# Altium schematic sheet 1_P1.schdoc
size 307 x 218 mm; Symbol: Drawing-Symbol_A4; Device: Drawing-Symbol_A4; Company: 嘉立创EDA; Version: V1.0; Page Size: A4; @Project Name: 25国赛; @Page Count: 1; @Update Date: 2025-08-01; @Create Date: 2025-08-01; @Schematic Name: Schematic1_1; @Page No: 1; @Page Name: P1; @Create Time: 12:12:55; @Update Time: 12:12:57; Width: 1170; Height: 825; Region Start: 1; X Region Count: 6; Y Region Count: 4; Blade Width: 10; Title Block Position: 3; @Board Name: OPA365跟随
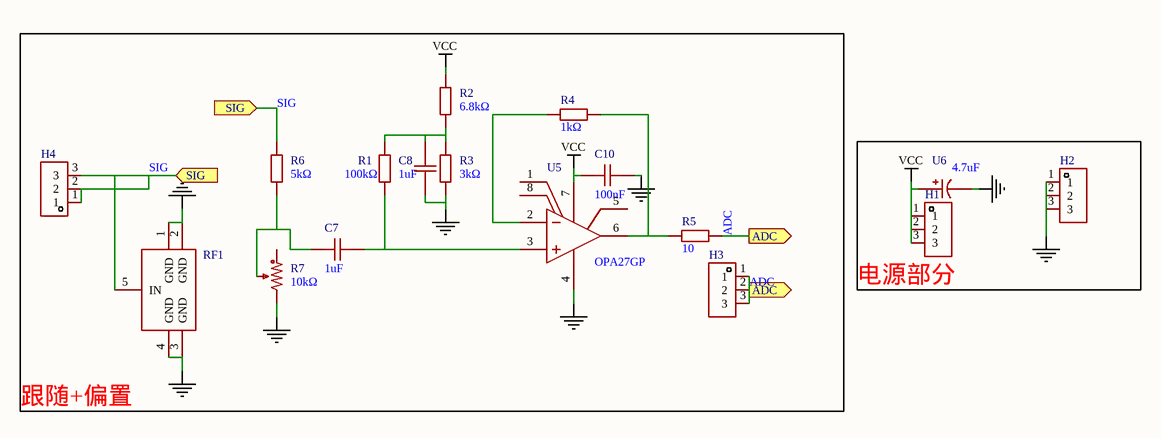
[diagram p0: 1_P1.schdoc]

## Parts
C7  1uF  [CAP-TH_L5.5-W3.8-P3.50-D0.6]
C8  1uF  [CAP-TH_L5.5-W3.8-P3.50-D0.6]
C10  100nF  [CAP-TH_L5.0-W2.5-P5.00-D1.0]
H1  PZ254V-11-03P  [HDR-TH_3P-P2.54-V-M]  (value not drawn)
H2  PZ254V-11-03P  [HDR-TH_3P-P2.54-V-M]  (value not drawn)
H3  PZ254V-11-03P  [HDR-TH_3P-P2.54-V-M]  (value not drawn)
H4  PZ254V-11-03P  [HDR-TH_3P-P2.54-V-M]  (value not drawn)
R1  100kΩ  [RES-TH_BD2.7-L6.2-P10.20-D0.4]
R2  6.8kΩ  [RES-TH_BD2.7-L6.2-P10.20-D0.4]
R3  3kΩ  [RES-TH_BD2.7-L6.2-P10.20-D0.4]
R4  1kΩ  [RES-TH_BD2.3-L6.5-P10.50-D0.5]
R5  10  [RES-TH_BD2.3-L6.5-P10.50-D0.5]
R6  5kΩ  [RES-TH_BD2.7-L6.2-P10.20-D0.4]
R7  10kΩ  [RES-ADJ-TH_3P-L10.0-W10.0-P2.50-L]
RF1  KH-SMA-K513-G  [ANT-TH_KH-SMA-K513-G]  (value not drawn)
U5  OPA27GP  [PDIP-8_L9.6-W6.4-P2.54-LS7.6-BL]
U6  4.7uF  [CAP-TH_BD8.0-P3.50-D0.6-FD_1]

## Blocks framed on the sheet
跟随+偏置: C7 C8 C10 H3 H4 R1-R7 RF1 U5
电源部分: H1 H2 U6

## Ports
ADC (out), SIG (in)

## Nets
GND: C8.1 C10.2 H2.1 H2.2 H2.3 R3.1 R7.3 RF1.1(GND) RF1.2(GND) RF1.3(GND) RF1.4(GND) U5.4(-VCC) U6.2
VCC: C10.1 H1.1 H1.2 H1.3 R2.2 U5.7(+VCC) U6.1
ADC: H3.1 H3.2 H3.3 R5.1 ; port ADC
SIG: H4.1 H4.2 H4.3 R6.2 RF1.5(IN) ; port SIG
NetC7_1: C7.1 R6.1 R7.2
NetC7_2: C7.2 R1.1 U5.3(IN+)
NetC8_2: C8.2 R1.2 R2.1 R3.2
NetR4_1: R4.1 R5.2 U5.6(OUT)
NetR4_2: R4.2 U5.2(IN-)

Not connected (* = marked no-connect by the designer): R7 1; U5 1(Offset_Trim) 5(NC) 8(Offset_Trim)

## Notes on the sheet
- 1
- 2
- 3
- 4
- 5
- 6
- A
- B
- C
- 原理图
- Schematic1_1
- 创建日期
- 更新日期
- 2025-08-01
- 板子
- 绘制
- OPA365跟随
- 图页
- P1
- D
- 审阅
- 版本
- 尺寸
- 25国赛
- 页    1    共    1
- V1.0
- A4
- 嘉立创EDA

## Library data of the parts
C7 C8 = CD1E106MC9BER2F100: Manufacturer: Dersonic(德尔创); Add into BOM: yes; Tolerance: ±20%; Voltage Rated: 25V; Temperature Coefficient: X5R; Symbol: CD1E106MC9BER2F100; Device: CD1E106MC9BER2F100; Supplier: LCSC; Manufacturer Part: CD1E106MC9BER2F100; Value: 1uF; JLCPCB Part Class: 扩展库; LCSC Part Name: 10uF ±20% 25V; Supplier Footprint: 插件,P=5.08mm; Datasheet: https://atta.szlcsc.com/upload/public/pdf/source/20210512/C2761733_48A4F8FFA54EF14BEC181E01EC41507A.pdf; Convert to PCB: yes
C10 = CC1H104MC1FD3F6C10MF: Manufacturer: Dersonic(德尔创); Add into BOM: yes; Tolerance: ±20%; Voltage Rated: 50V; Temperature Coefficient: Y5V; φD: 6mm; Body Thickness: 2.2mm; Symbol: CC1H104MC1FD3F6C10MF; Device: CC1H104MC1FD3F6C10MF; Supplier: LCSC; Supplier Part: C254085; Manufacturer Part: CC1H104MC1FD3F6C10MF; Value: 100nF; JLCPCB Part Class: 扩展库; LCSC Part Name: 100nF ±20% 50V; Supplier Footprint: 插件,P=5.08mm; Datasheet: https://atta.szlcsc.com/upload/public/pdf/source/20200826/C254085_159DD65BF32BF11C9168D341BCE23E6F.pdf; Convert to PCB: yes; Lead Spacing: 5.08mm
H1-H4 = PZ254V-11-03P: Manufacturer: XFCN(兴飞); Symbol: PZ254V-11-03P_C2937625; Add into BOM: yes; Pin Structure: 1x3P; Pitch: 2.54mm; Circluar Pins/Square Pins: 方针; Current Rating (Max): 3A; Voltage Rating (Max): 250V; Device: PZ254V-11-03P; LCSC Part Name: 间距:2.54mm 1x3P 直插 方针; Supplier Part: C2937625; Manufacturer Part: PZ254V-11-03P; Supplier Footprint: 插件,P=2.54mm; JLCPCB Part Class: 扩展库; Datasheet: https://atta.szlcsc.com/upload/public/pdf/source/20200309/C492402_8335C3D49C4E4C618838D59BB1D024C1.pdf; Supplier: LCSC; Convert to PCB: yes; Row Spacing: -; Mounting Type: 直插; Number of Rows: 单排; Number of Pins: 3P; Length of Mating Pin: 6mm; Insulation Height: 2.5mm; Length of End Connection Pin: 3mm; Operating Temperature Range: -40℃~+105℃; Color: 黑色
R1-R3 R6 = MF1/4W-100K±1%-OT26: Manufacturer: VO(翔胜); Add into BOM: yes; Tolerance: ±1%; Overload Voltage (Max): 250V; Power(Watts): 250mW; Temperature Coefficient: ±350ppm/℃; Symbol: MF1/4W-100K±1%-OT26; Device: MF1/4W-100K±1%-OT26; LCSC Part Name: 金属膜电阻 100kΩ ±1% 250mW; Manufacturer Part: MF1/4W-100K±1%-OT26; Supplier Footprint: 插件,D2.7xL6.2mm; JLCPCB Part Class: 扩展库; Datasheet: https://atta.szlcsc.com/upload/public/pdf/source/20200609/C601728_5AA4C0C8E12E11069DA2C3356F29D1F2.pdf; Supplier: LCSC; Convert to PCB: yes; Type: 金属膜电阻; Operating Temperature Range: -55℃~+155℃
  R1: Supplier Part: C2843019; Value: 100kΩ
  R2: Value: 6.8kΩ
  R3: Value: 3kΩ
  R6: Value: 5kΩ
R4 R5 = MF1/4W-20KΩ±1% T: Manufacturer: CCO(千志电子); Symbol: MF1/4W-20KΩ±1% T52; Add into BOM: yes; Tolerance: ±1%; Overload Voltage (Max): 250V; Power(Watts): 250mW; Temperature Coefficient: ±100ppm/℃; Device: MF1/4W-20KΩ±1% T; LCSC Part Name: 20kΩ ±1% 250mW 金属膜电阻; Manufacturer Part: MF1/4W-20KΩ±1% T; Supplier Footprint: 插件,D2.3xL6.5mm; JLCPCB Part Class: 扩展库; Datasheet: https://atta.szlcsc.com/upload/public/pdf/source/20190910/C427326_62A6D058BC0FF74963A2F22379CA06CE.pdf; Supplier: LCSC; Convert to PCB: yes; Type: 金属膜电阻; Operating Temperature Range: -55℃~+155℃
  R4: Value: 1kΩ
  R5: Value: 10
R7 = 3296W-1-103: Manufacturer: BOCHEN(博晨); Add into BOM: yes; Tolerance: ±10%; Symbol: 3296W-1-103; Device: 3296W-1-103; LCSC Part Name: 10kΩ ±10%; Manufacturer Part: 3296W-1-103; Supplier Footprint: 插件; JLCPCB Part Class: 扩展库; Datasheet: https://atta.szlcsc.com/upload/public/pdf/source/20171114/C118954_15106326646611117443.pdf; Supplier: LCSC; Convert to PCB: yes; Value: 10kΩ
RF1 = KH-SMA-K513-G: Manufacturer: kinghelm(金航标); Add into BOM: yes; Connector Type: 板端; Interface Type: 内孔; Number of Ports: 1; Frequency-Max: 6GHz; RF Series: SMA; Impedance: 50Ω; Style: 弯头; Symbol: KH-SMA-K513-G; Device: KH-SMA-K513-G; LCSC Part Name: SMA 内孔 弯头; Supplier Part: C411575; Manufacturer Part: KH-SMA-K513-G; Supplier Footprint: 插件; JLCPCB Part Class: 扩展库; Datasheet: https://atta.szlcsc.com/upload/public/pdf/source/20210317/C411575_49039CD64129040639EC5218E5A2C783.pdf; Supplier: LCSC; Convert to PCB: yes; Interface Diameter: -; Interface Length/Height: -; Operating Temperature Range: -55℃~+155℃
U5 = OPA27GP: Manufacturer: TI(德州仪器); Add into BOM: yes; Number of Circuits: 单路; Gain Bandwidth Product(GBP): 8MHz; Current - Input Bias(Ib): 15nA; Slew Rate(SR): 1.9V/us; Output Current: 25mA; Symbol: OPA27GP; Device: OPA27GP; LCSC Part Name: OPA27GP; Supplier Part: C1346270; Manufacturer Part: OPA27GP; Supplier Footprint: PDIP-8; JLCPCB Part Class: 扩展库; Datasheet: https://www.ti.com/cn/lit/gpn/opa27; Supplier: LCSC; Convert to PCB: yes; Output Type: -; Rail to Rail: -; Operating Temperature: -40℃~+85℃
U6 = 87EC0068: Manufacturer: KNSCHA(科尼盛); Add into BOM: yes; Tolerance: ±20%; Voltage Rating: 400V; Ripple Current: 150mA@100kHz; Equivalent Series Resistance(ESR): 3Ω@100kHz; Pin Spacing: 3.5mm; Lifetime: 10000hrs@105℃; Symbol: 87EC0068; Device: 87EC0068; LCSC Part Name: 4.7uF ±20% 400V; Supplier Part: C2687411; Manufacturer Part: 87EC0068; Supplier Footprint: 插件,D8xL12mm; JLCPCB Part Class: 扩展库; Datasheet: https://atta.szlcsc.com/upload/public/pdf/source/20210128/C2687411_47D152122E02B3F51C123914ADA73DFA.pdf; Supplier: LCSC; Convert to PCB: yes; Value: 4.7uF; Diameter: 8mm; Height - Seated (Max): 12mm; Operating Temperature: -25℃~+105℃